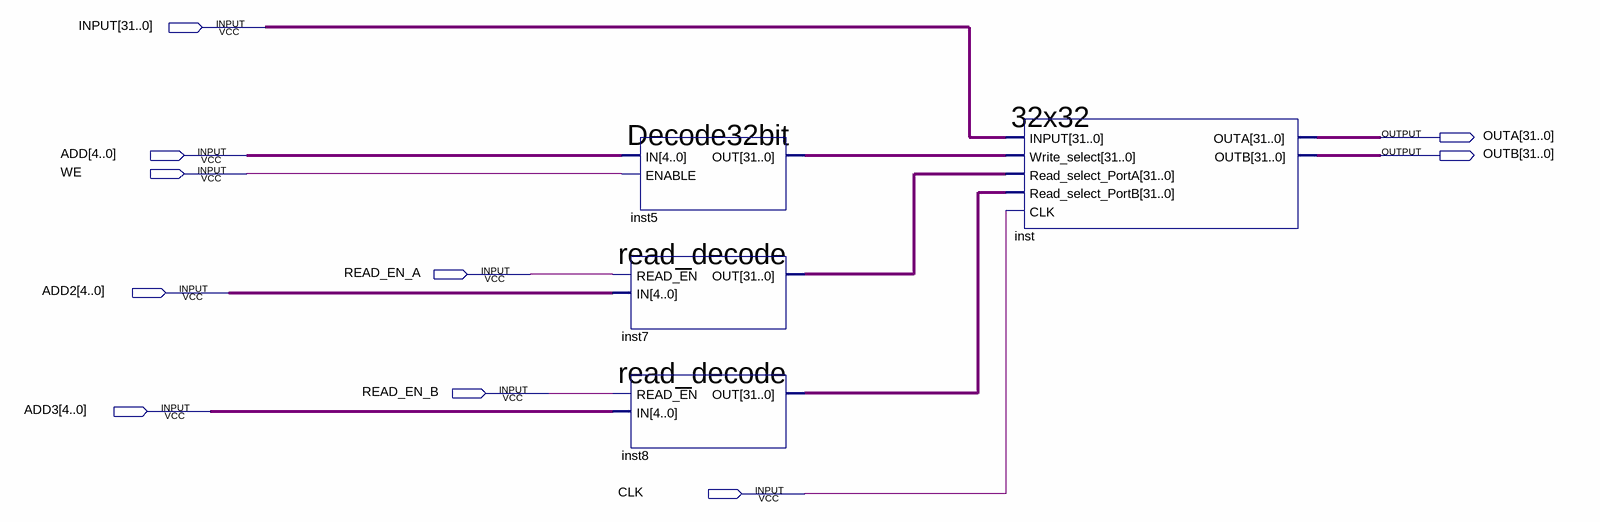
[diagram p0: schematic sheet]
// Quartus schematic register_file.bdf as structural Verilog: 4 symbols, 10 pins
module register_file (
  input  [31:0] INPUT,
  input  [4:0] ADD,
  input  WE,
  input  READ_EN_A,
  input  [4:0] ADD2,
  input  READ_EN_B,
  input  [4:0] ADD3,
  input  CLK,
  output [31:0] OUTA,
  output [31:0] OUTB
);

  wire [31:0] inst5_out, inst7_out, inst8_out;

  Decode32bit inst5 (.IN(ADD), .ENABLE(WE), .OUT(inst5_out));
  read_decode inst7 (.READ_EN(READ_EN_A), .IN(ADD2), .OUT(inst7_out));
  read_decode inst8 (.READ_EN(READ_EN_B), .IN(ADD3), .OUT(inst8_out));
  \32x32  inst (
    .INPUT(INPUT), .Write_select(inst5_out), .Read_select_PortA(inst7_out), .Read_select_PortB(inst8_out),
    .CLK(CLK), .OUTA(OUTA), .OUTB(OUTB));
endmodule
